# Altium schematic sheet Sheet1.SchDoc
size A4; SheetNumber: 1; SheetTotal: 1; SPICEModelCacheEMDDXBVT: <root> / <DocumentId>EMDDXBVT</DocumentId> / <CacheFrame Number="0"> / <Model Name="diode" Kind="MDL"> / <Text>.MODEL diode D ()</Text> / </Model> / </CacheFrame> / </root>
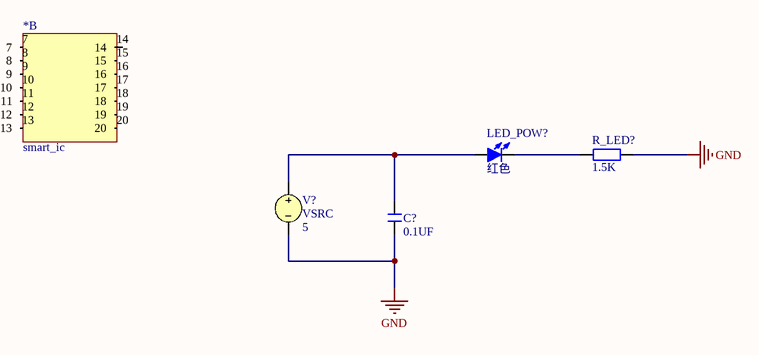
[diagram p0: Sheet1.SchDoc]

## Parts
*  smart_ic  (part B of 5)
C?  0.1UF  [C 0603]
LED_POW?  红色  [LED 0603R]
R_LED?  1.5K  [R 0603]
V?  VSRC  value 5

## Nets
GND: C?.1 R_LED?.2 V?.2
NetC?_2: C?.2 LED_POW?.1(A) V?.1
NetLED_POW?_2: LED_POW?.2(K) R_LED?.1

Not connected (* = marked no-connect by the designer): * 7 8 9 10 11 12 13 14 15 16 17 18 19 20

## Library data of the parts
C? = C: 无极性贴片电容; 版权归属: 源创客; Value: 1n; BOM名称: 无极性贴片电容; 学习资源: www.ooocke.com
LED_POW? = LED-SMD: 贴片LED; 版权归属: 源创客; Value: 1u; BOM名称: 贴片LED; 学习资源: www.ooocke.com
R_LED? = R: 贴片电阻; 版权归属: 源创客; Value: 1K; BOM名称: 贴片电阻; 学习资源: www.ooocke.com
V? = VSRC: Voltage Source; Note: PCB Footprint - Not required; AC Magnitude: 1; AC Phase: 0; Published: 30-July-2020; LatestRevisionDate: 30-July-2020; LatestRevisionNote: Re-released for DXP Platform.; PackageReference: Not Applicable; Publisher: Altium Limited